# Altium schematic sheet SubsystemD_LO_Schematic.SchDoc
size A
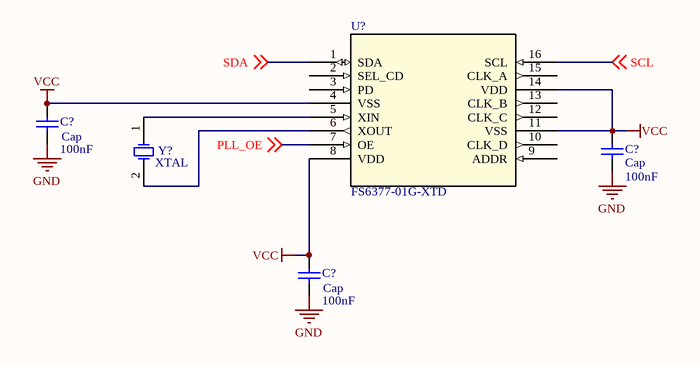
[diagram p0: SubsystemD_LO_Schematic.SchDoc]

## Parts
(Parts that share a designator on the sheet are numbered #1, #2 ... from top to bottom, then left to right.)
C?#1  Cap  value 100nF  [RAD-0.3]
C?#2  Cap  value 100nF  [RAD-0.3]
C?#3  Cap  value 100nF  [RAD-0.3]
U?  FS6377-01G-XTD  [SOIC-16_ONS]
Y?  XTAL  [R38]

## Nets
GND: C?#1.1 C?#2.1 C?#3.1
VCC: C?#1.2 C?#2.2 C?#3.2 U?.4(VSS) U?.8(VDD) U?.11(VSS) U?.14(VDD)
PLL_OE: U?.7(OE) ; off-sheet PLL_OE
SCL: U?.16(SCL) ; off-sheet SCL
SDA: U?.1(SDA) ; off-sheet SDA
NetU?_5: U?.5(XIN) Y?.1(OSC1)
NetU?_6: U?.6(XOUT) Y?.2(OSC2)

Not connected (* = marked no-connect by the designer): U? 2(SEL_CD) 3(PD) 9(ADDR) 10(CLK_D) 12(CLK_C) 13(CLK_B) 15(CLK_A)

## Library data of the parts
C?#1-C?#3 = Cap: Capacitor; Published: 8-Jun-2000; LatestRevisionDate: 17-Jul-2002; LatestRevisionNote: Re-released for DXP Platform.; PackageReference: RAD-0.3; Publisher: Altium Limited; PackageDescription: Radial Cap, Thru-Hole; 2 Leads; 0.3 in Pin Spacing
U? = FS6377-01G-XTD: No Description Available; Vendor: ON Semiconductor; SourceLibrary: ONSemi_2017-12-12_1; Manufacturer_Part_Number: FS6377-01G-XTD; Copyright: Copyright (C) 2016 Accelerated Designs. All rights reserved; RefDes: RefDes; Type: DEV
Y? = XTAL: Crystal Oscillator; Published: 8-Jun-2000; LatestRevisionDate: 17-Jul-2002; LatestRevisionNote: Re-released for DXP Platform.; PackageReference: R38; Publisher: Altium Limited; PackageDescription: Crystal, Thru-Hole; 2 Leads; Body 3.1 x 8.2 mm (Dia.xH)